# Altium schematic sheet 10 MSM8916_POWER1.SchDoc
size 871 x 576 mm
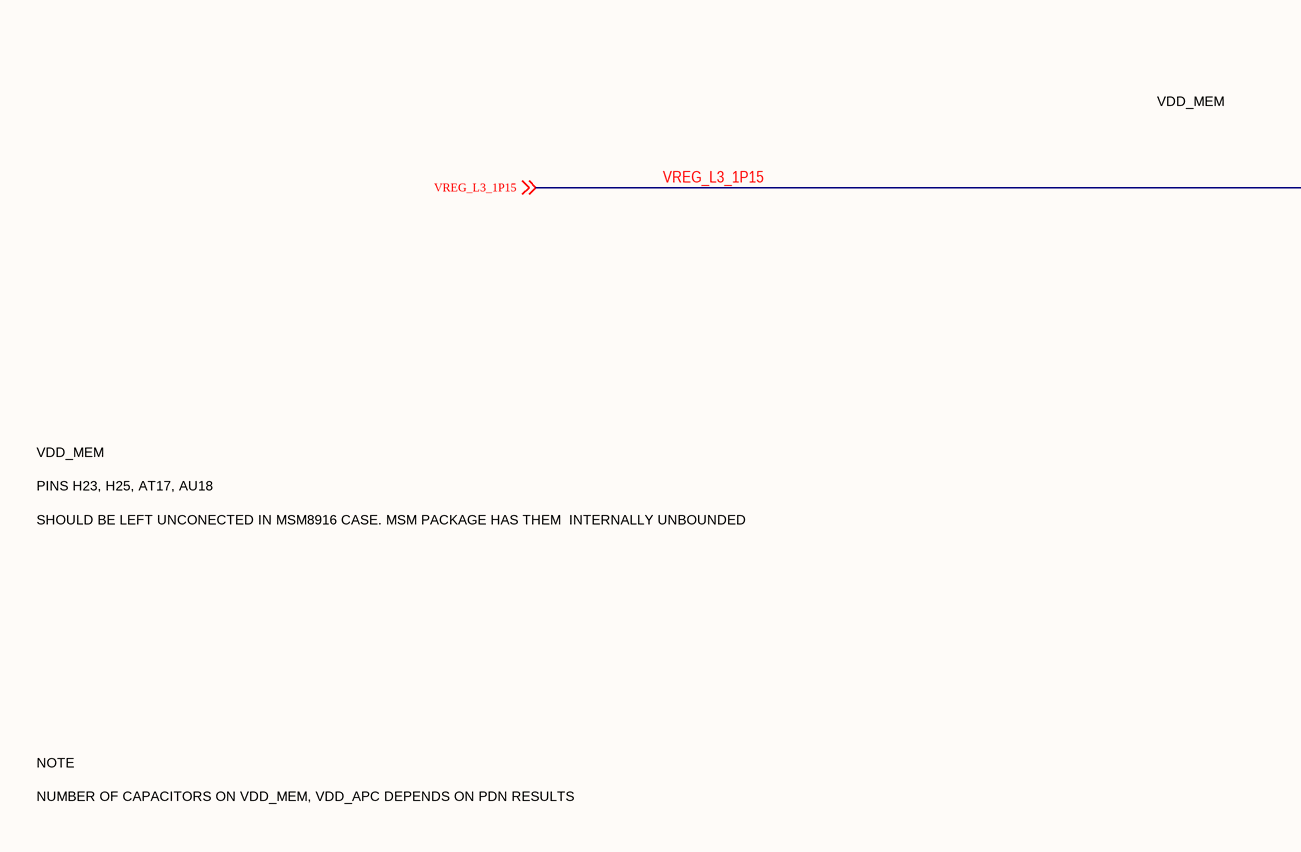
[diagram p0: 10 MSM8916_POWER1.SchDoc, top left]
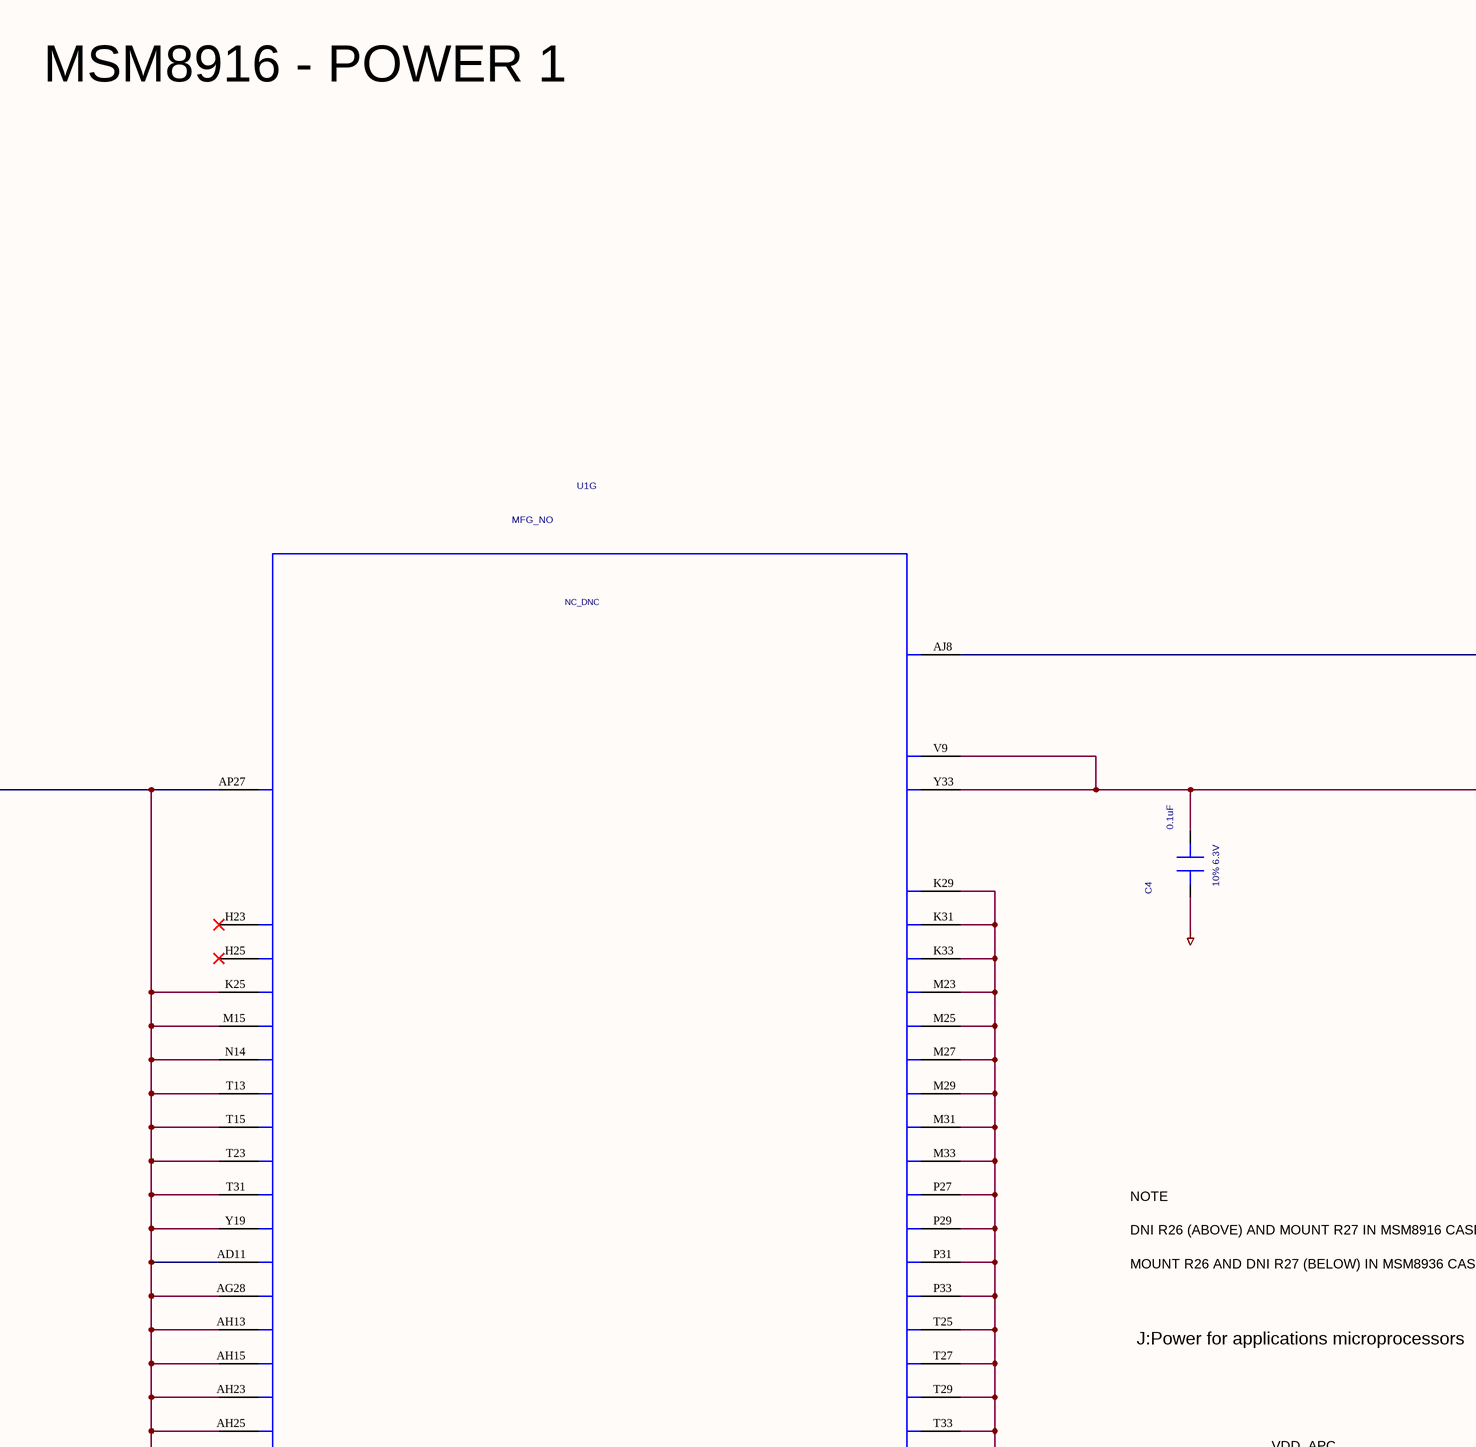
[diagram p1: 10 MSM8916_POWER1.SchDoc, top middle]
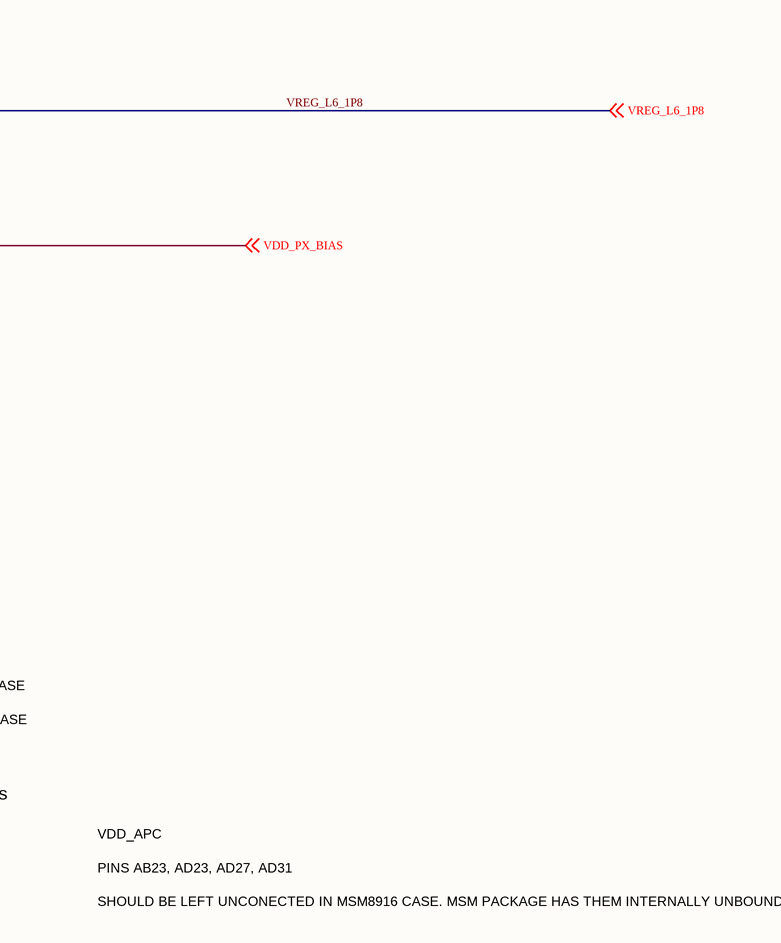
[diagram p2: 10 MSM8916_POWER1.SchDoc, top right]
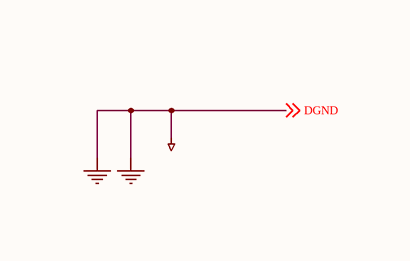
[diagram p3: 10 MSM8916_POWER1.SchDoc, bottom left]
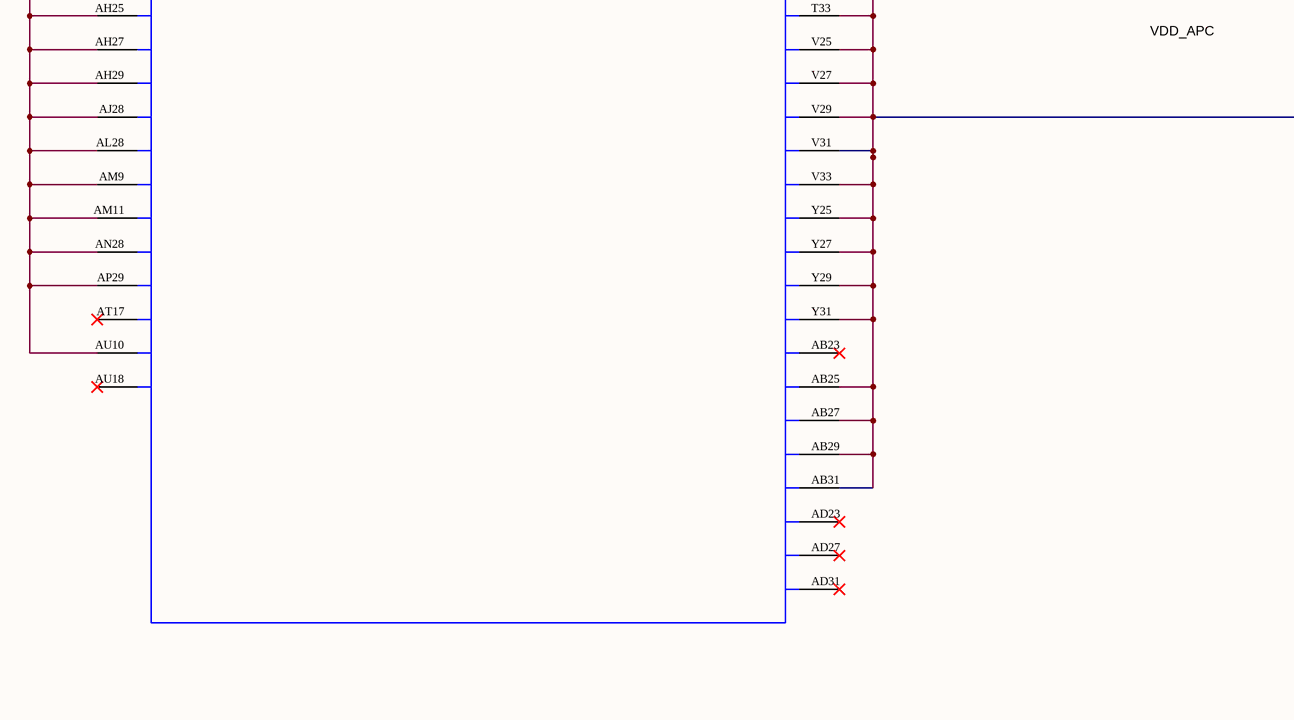
[diagram p4: 10 MSM8916_POWER1.SchDoc, bottom middle]
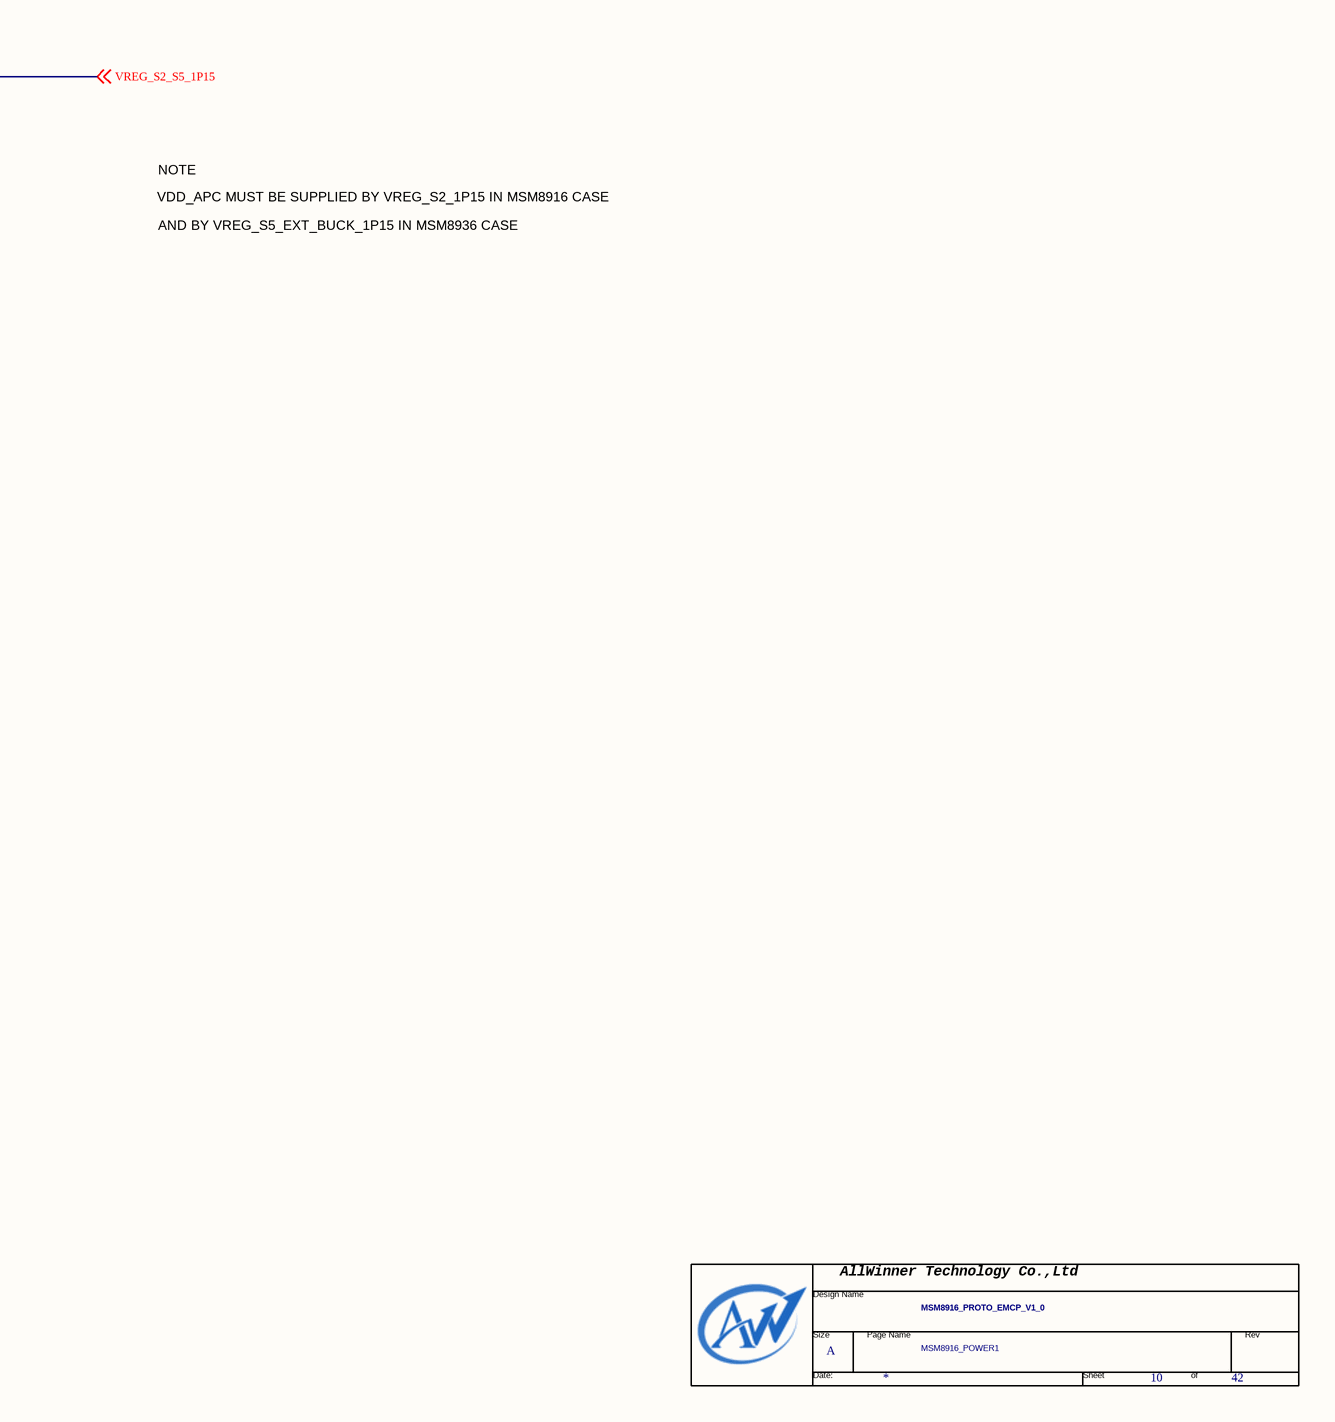
[diagram p5: 10 MSM8916_POWER1.SchDoc, bottom right]

## Parts
*  Page Count: 42  Page Number: 10  Page Size: A  Title: MSM8916_PROTO_EMCP_V1_0  Doc: MSM8916_POWER1  (hidden comment: TitleBlock0-AW)  (graphical)
C4  0.1uF  Tolerance: 10% 6.3V
U1  SYMNAME: NC_DNC  PART_ID: MFG_NO  [MSM-8916-0-760NSP-TR-00-0]  (hidden comment: ASIC_MSM8936_760PIN)  (part G of 13)

## Nets
DGND: C4.1(POS) ; off-sheet DGND  [also labelled GND]
VDD_PX_BIAS: C4.2(NEG) U1.V9(VDDPX_VBIAS_SDC) U1.Y33(VDDPX_VBIAS_UIM) ; off-sheet VDD_PX_BIAS
VREG_L3_1P15: U1.AD11(VDDMX_1_11) U1.AG28(VDDMX_1_12) U1.AH13(VDDMX_1_13) U1.AH15(VDDMX_1_14) U1.AH23(VDDMX_1_15) U1.AH25(VDDMX_1_16) U1.AH27(VDDMX_1_17) U1.AH29(VDDMX_1_18) U1.AJ28(VDDMX_1_19) U1.AL28(VDDMX_1_20) U1.AM9(VDDMX_1_21) U1.AM11(VDDMX_1_22) U1.AN28(VDDMX_1_23) U1.AP27(VDDMX_TXDAC) U1.AP29(VDDMX_1_24) U1.AU10(VDDMX_1_26) U1.K25(VDDMX_1_3) U1.M15(VDDMX_1_4) U1.N14(VDDMX_1_5) U1.T13(VDDMX_1_6) U1.T15(VDDMX_1_7) U1.T23(VDDMX_1_8) U1.T31(VDDMX_1_9) U1.Y19(VDDMX_1_10) ; off-sheet VREG_L3_1P15
VREG_L6_1P8: U1.AJ8(QFPROM_BLOW_VDD) ; off-sheet VREG_L6_1P8
VREG_S2_S5_1P15: U1.AB25(VDD_APC_28) U1.AB27(VDD_APC_29) U1.AB29(VDD_APC_30) U1.AB31(VDD_APC_31) U1.K29(VDD_APC_1) U1.K31(VDD_APC_2) U1.K33(VDD_APC_3) U1.M23(VDD_APC_4) U1.M25(VDD_APC_5) U1.M27(VDD_APC_6) U1.M29(VDD_APC_7) U1.M31(VDD_APC_8) U1.M33(VDD_APC_9) U1.P27(VDD_APC_10) U1.P29(VDD_APC_11) U1.P31(VDD_APC_12) U1.P33(VDD_APC_13) U1.T25(VDD_APC_14) U1.T27(VDD_APC_15) U1.T29(VDD_APC_16) U1.T33(VDD_APC_17) U1.V25(VDD_APC_18) U1.V27(VDD_APC_19) U1.V29(VDD_APC_20) U1.V31(VDD_APC_21) U1.V33(VDD_APC_22) U1.Y25(VDD_APC_23) U1.Y27(VDD_APC_24) U1.Y29(VDD_APC_25) U1.Y31(VDD_APC_26) ; off-sheet VREG_S2_S5_1P15

Not connected (* = marked no-connect by the designer): U1 AB23(VDD_APC_27)* AD23(VDD_APC_32)* AD27(VDD_APC_33)* AD31(VDD_APC_34)* AT17(VDDMX_1_25)* AU18(VDDMX_1_27)* H23(VDDMX_1_1)* H25(VDDMX_1_2)*

## Notes on the sheet
- MSM8916 - POWER 1
- VDD_MEM
- SHOULD BE LEFT UNCONECTED IN MSM8916 CASE. MSM PACKAGE HAS THEM  INTERNALLY UNBOUNDED
- PINS H23, H25, AT17, AU18
- DNI R26 (ABOVE) AND MOUNT R27 IN MSM8916 CASE
- NOTE
- MOUNT R26 AND DNI R27 (BELOW) IN MSM8936 CASE
- J:Power for applications microprocessors
- VDD_APC
- NUMBER OF CAPACITORS ON VDD_MEM, VDD_APC DEPENDS ON PDN RESULTS
- SHOULD BE LEFT UNCONECTED IN MSM8916 CASE. MSM PACKAGE HAS THEM INTERNALLY UNBOUNDED
- PINS AB23, AD23, AD27, AD31
- VDD_APC MUST BE SUPPLIED BY VREG_S2_1P15 IN MSM8916 CASE
- AND BY VREG_S5_EXT_BUCK_1P15 IN MSM8936 CASE
- (in symbol TitleBlock0-AW) AllWinner Technology Co.,Ltd; Design Name; Size; Page Name; Rev; Date:; Sheet; of

## Library data of the parts
C4 = CAP#1: PART_NUMBER: MCN_NO; PART_ID: MFG_NO; OriginalSymbolOrigin: (-75,50); VOLT: ?V; SYMNAME: CAP; CDS_LMAN_SYM_OUTLINE: -25,50,25,-50; PACK_TYPE: ?
U1 = ASIC_MSM8936_760PIN: PART_NUMBER: MCN_NO; OriginalSymbolOrigin: (-1100,2500); SPLIT_INST: TRUE; CDS_LMAN_SYM_OUTLINE: -1050,2500,1050,-2500; CDS_LMAN_SPLIT_NUMBER: 1 of 13; PACK_TYPE: ?
* = TitleBlock0-AW: RevCode: ?; Page Create Date: March  8, 1995; Page Modify Date: *